# EAGLE design ArduinoProMini.NRF24.DHT (EAGLE 8.0.2)
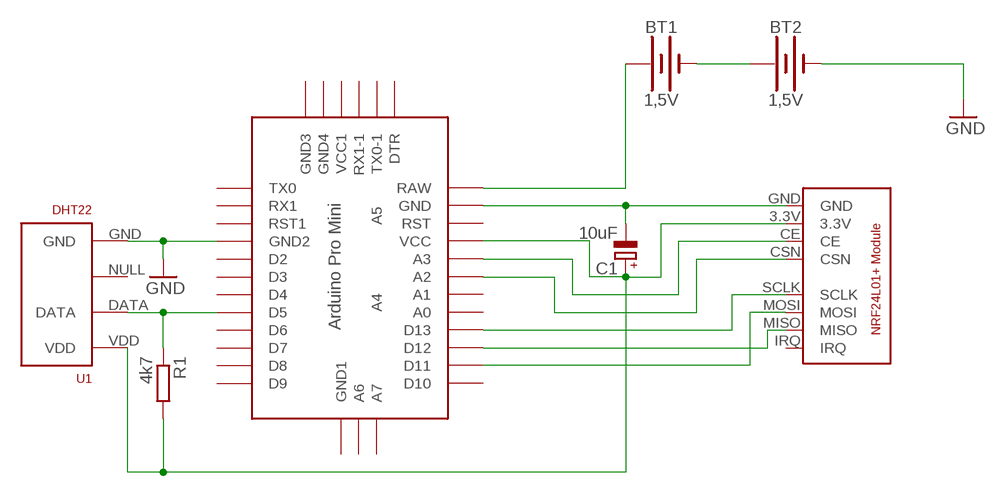
[diagram p0: schematic, sheet 1]

## Parts
BT1  1,5V  BATTERY-AA  [BATTERY-AA]
BT2  1,5V  BATTERY-AA  [BATTERY-AA]
C1  10uF  CPOL-EUE2-5  [E2-5]
R1  4k7  R-EU_0204/7  [0204/7]
U1  DHT22  RHT03_DHT-22_AM2302RA  [RHT03_DHT-22/RA]
U$1  ABK-PRO-MINI  [ABK-PRO-MINI]
U$2  NRF24L01+MODULE  [NRF24L01+MODULE]

## Nets
3.3V: C1.+ R1.2 U1.VDD U$1.VCC U$2.3.3V
GND: BT2.GND@1(-) C1.- U1.GND U$1.GND U$1.GND1(GND2) U$2.GND
N$1: BT1.GND@1(-) BT2.PWR@1(+)
N$2: R1.1 U1.DATA U$1.D5
N$6: U$1.A3 U$2.CE
N$7: U$1.A2 U$2.CSN
N$8: U$1.D13 U$2.SCLK
N$9: U$1.D11 U$2.MOSI
N$10: U$1.D12 U$2.MISO
RAW: BT1.PWR@1(+) U$1.RAW
Unconnected: U1.NULL U$1.A0 U$1.A1 U$1.A4 U$1.A5 U$1.A6 U$1.A7 U$1.D2 U$1.D3 U$1.D4 U$1.D6 U$1.D7 U$1.D8 U$1.D9 U$1.D10 U$1.DTR U$1.GND2(GND3) U$1.GND3(GND4) U$1.GND4(GND1) U$1.RST U$1.RST1 U$1.RX1 U$1.RX1-1 U$1.TX0 U$1.TX0-1 U$1.VCC1 U$2.IRQ

## Library data of the parts
BT1 BT2 = SparkFun-Batteries:BATTERY: Battery - Single Cell A variety of battery chemistries, sizes, and footprints. Device List: 20MM_PTH - Coin Cell Battery Holder - 20mm (PTH) <https://www.sparkfun.com/products/783> 12MM_SMD - Coin Cell Battery Holder - 12mm (SMD) <https://www.sparkfun.com/products/10592> 12MM_PTH - Coin Cell Battery Holder - 12mm (PTH) <https://www.sparkfun.com/products/7948> 20MM_SMD - 20mm Coin Cell Battery Holder (SMD) (2 legs) Used on the Big Time Watch Kit <https://www.sparkfun.com/products/11734> 20MM_SMD_4LEGS - Coin Cell Battery Holder - 20mm (SMD) <https://www.sparkfun.com/products/11892> 20MM_SMD_4LEGS_OVERPASTE - Coin Cell Battery Holder - 20mm (SMD) <https://www.sparkfun.com/products/11892> (Over-paste on the legs) 24.5MM_PTH - Coin Cell Battery Holder - 24.5mm (PTH) <https://www.sparkfun.com/products/8863> 9V - 9V Battery Holder - PC Mount Used on the SparkFun SparkPunk Sound Kit <https://www.sparkfun.com/products/11177> and SparkFun SparkPunk Sequencer Kit <https://www.sparkfun.com/products/12707> 18650 - Battery Holder - 18650 (PTH) <https://www.sparkfun.com/products/13113> AA - Battery Holder - 1xAA (PTH) <https://www.sparkfun.com/products/7949> AAA - Battery Holder - 1xAAA (PTH) <https://www.sparkfun.com/products/12718> AA_KIT - Battery Holder - 1xAA (PTH) <https://www.sparkfun.com/products/7949> Special kit package - pads only have exposed copper on one side of the board. AAA_KIT - Battery Holder - 1xAAA (PTH) <https://www.sparkfun.com/products/12718> Special kit package - pads only have exposed copper on one side of the board.; PROD_ID: BATT-08316; SF_SKU: PRT-07949
C1 = rcl:CPOL-EU: POLARIZED CAPACITOR, European symbol
R1 = resistor:R-EU_: RESISTOR, European symbol
U1 = RHT03_DHT-22_AM2302:RHT03_DHT-22_AM2302: RHT03 / DHT-22 / AM2302 Packages and symbol for the RHT03 / DHT-22 relative humidity and temperature sensor. Note: The AM2302 is a wired version of the DHT-22 which typically requires less clearance and is thus provided as a separate package.; PROD_ID: SEN-10167
U$1 = Arduino-clone:ABK-PRO-MINI: ABK Pro-Mini Arduino Clone
U$2 = NRF24L01+ Module:NRF24L01+MODULE

## Board
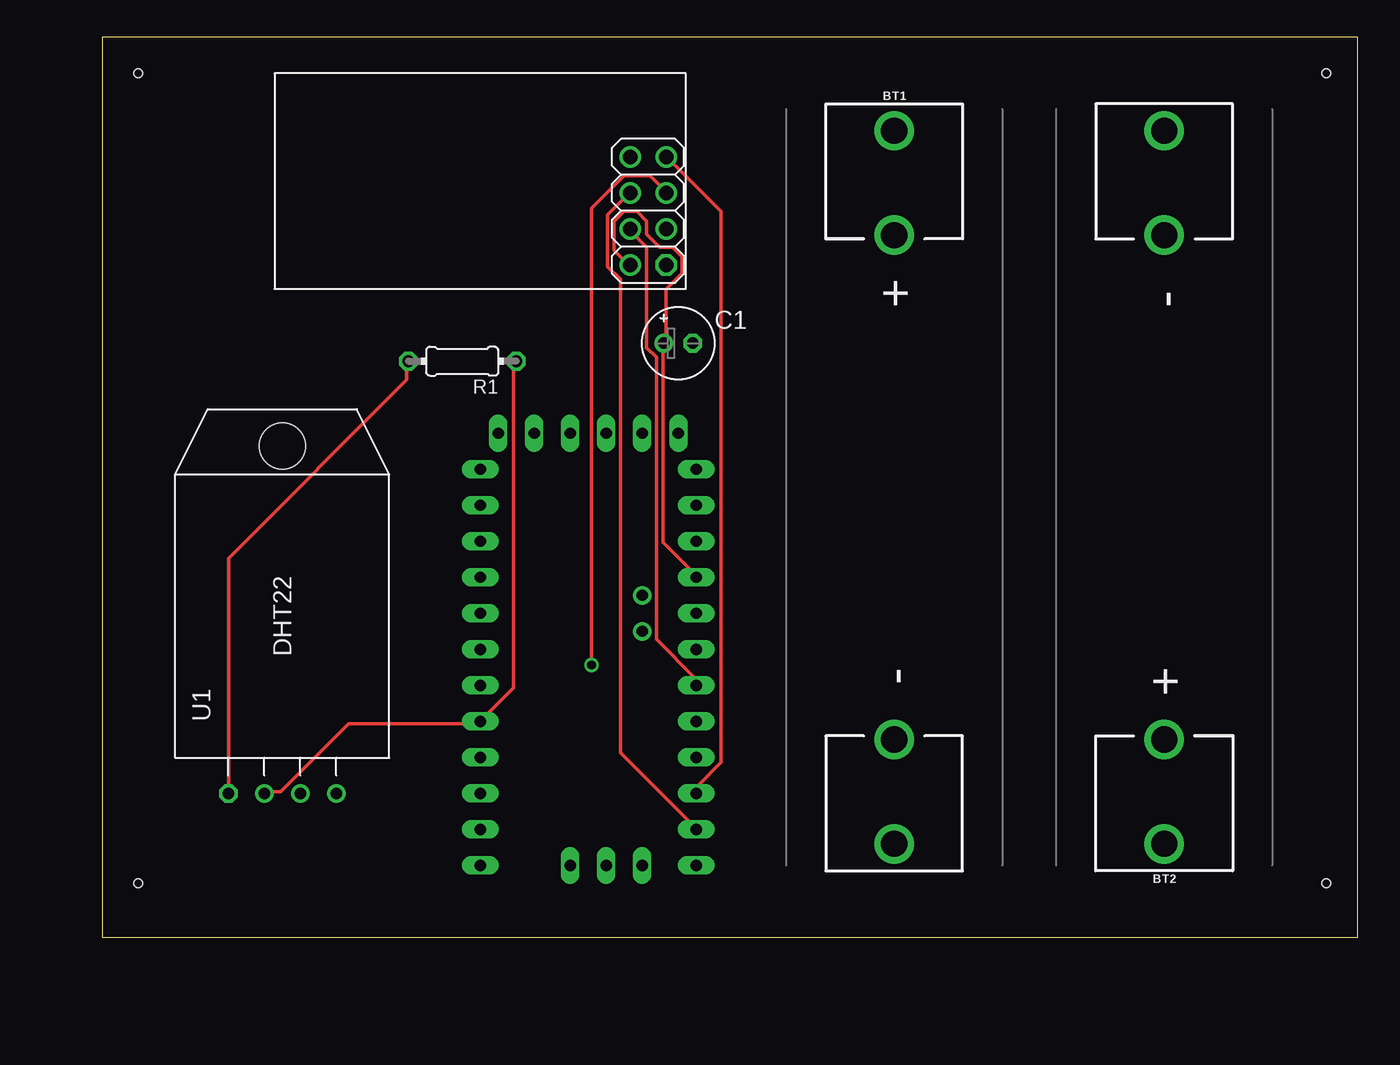
[diagram p1: board, top side]
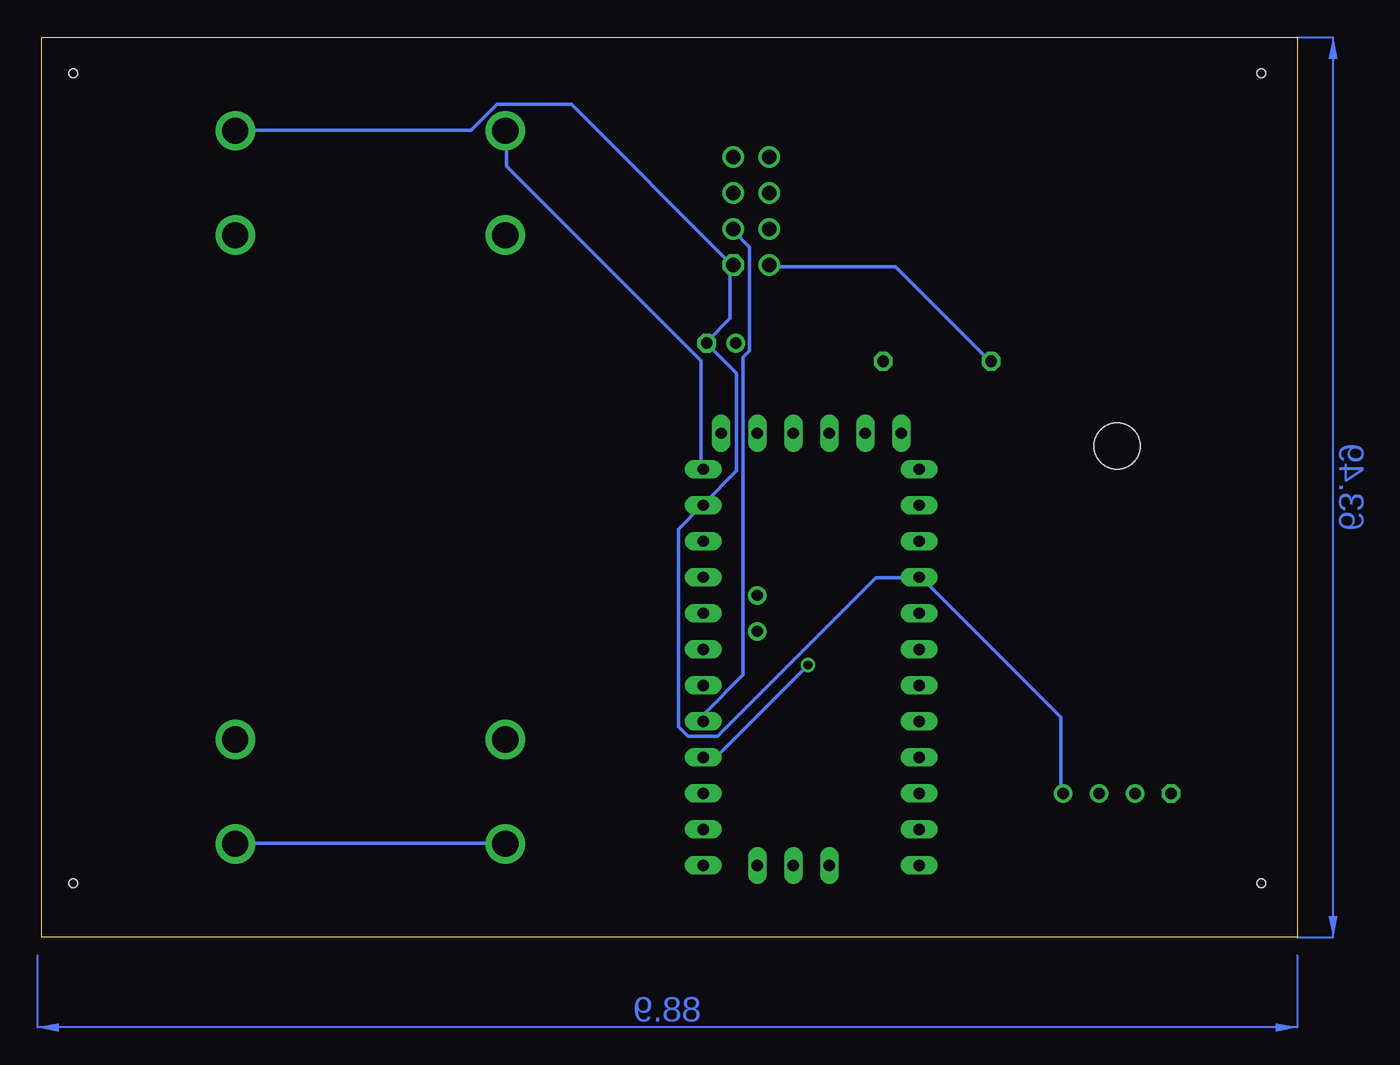
[diagram p2: board, bottom side, seen from below]

Size 88.57 x 63.49 mm. Coordinates in mm from the lower left corner, seen from the top.
Outline: 0,0 88.57,0 88.57,63.49 0,63.49 0,0
Copper layers (1*16): Top 0.035mm / dielectric 1.5mm / Bottom 0.035mm
Design rules "default": minimum track width 10mil, minimum drill 24mil, track to track 8mil, track to pad 8mil, pad to pad 8mil, via to via 8mil, smd to smd 8mil, copper to edge 40mil, drill to drill 8mil, minimum pad ring 10mil, minimum via ring 8mil, stop-mask expansion 4mil, vias tented up to drill 0mil, thermal gap 10mil
Holes 0.6 mm at 2.54,3.81 2.54,60.96 86.36,60.96 86.36,3.81

### Footprints (pad centres in the part's own frame; a part is rotated, then mirrored left to right if it is on the bottom)
BATTERY-AA = drill 1.854: GND@1 25.146,0; GND@2 17.78,0; PWR@1 -25.146,0; PWR@2 -17.78,0
E2-5 = drill 0.813 pad 1.27: + -1.016,0 | drill 0.813 pad 1.27 octagon: - 1.016,0
0204/7 = drill 0.813 octagon: 1 -3.81,0; 2 3.81,0
RHT03_DHT-22/RA = drill 0.8: DATA -1.27,0; GND 3.81,0; NULL 1.27,0 | drill 0.8 octagon: VDD -3.81,0 | hole 3.25: 0,24.5
ABK-PRO-MINI = drill 0.8 long: A0 10.16,-3.81; A1 10.16,-6.35; A2 10.16,-8.89; A3 10.16,-11.43; A6 3.81,-21.59; A7 6.35,-21.59; D2 -5.08,-3.81; D3 -5.08,-6.35; D4 -5.08,-8.89; D5 -5.08,-11.43; D6 -5.08,-13.97; D7 -5.08,-16.51; D8 -5.08,-19.05; D9 -5.08,-21.59; D10 10.16,-21.59; D11 10.16,-19.05; D12 10.16,-16.51; D13 10.16,-13.97; DTR 8.89,8.89; GND 10.16,3.81; GND1 -5.08,-1.27; GND2 -3.81,8.89; GND3 -1.27,8.89; GND4 1.27,-21.59; RAW 10.16,6.35; RST 10.16,1.27; RST1 -5.08,1.27; RX1 -5.08,3.81; RX1-1 3.81,8.89; TX0 -5.08,6.35; TX0-1 6.35,8.89; VCC 10.16,-1.27; VCC1 1.27,8.89 | drill 0.8: A4 6.35,-5.08; A5 6.35,-2.54
NRF24L01+MODULE = drill 1.016: 3.3V 10.58,-5.91; CE 13.12,-3.37; CSN 10.58,-3.37; IRQ 10.58,1.71; MISO 13.12,1.71; MOSI 10.58,-0.83; SCLK 13.12,-0.83 | drill 1.016 octagon: GND 13.12,-5.91

### Placement (x,y rotation side)
BT1  55.88,31.75 270 top
BT2  74.93,31.75 90 top
C1  40.64,41.91 0 top
R1  25.4,40.64 180 top
U1  12.7,10.16 0 top
U$1  31.75,26.67 0 top
U$2  26.67,53.34 0 top

### Tracks (layer width: path | path; a pad name or v marks a point on that pad's centre or on a via)
3.3V
  Top 0.254: U$1.VCC 41.83,25.6 39.55,27.89 39.55,41.83 C1.+ 39.78,42.06 39.78,45.72 40.92,46.86 40.92,48.01 40.23,48.69 39.32,48.69 38.41,49.61 38.41,50.52 37.72,51.21 36.8,51.21 36.12,50.52 36.12,48.46 37.03,47.55 U$2.3.3V | U1.VDD 8.91,10.29 8.91,26.75 21.49,39.32 21.49,40.46 R1.2
  Bottom 0.254: U$2.3.3V 37.03,47.32 28.35,47.32 21.72,40.69 R1.2
GND
  Bottom 0.254: U1.GND 16.69,10.29 16.69,15.54 26.52,25.38 U$1.GND1 26.75,25.38 29.72,25.38 40.92,14.17 42.98,14.17 43.66,14.86 43.66,28.8 42.06,30.4 U$1.GND 41.83,30.63 39.55,32.92 39.55,39.78 41.6,41.83 C1.- 41.6,42.06 40.01,43.66 40.01,47.32 U$2.GND 40.01,47.55 51.21,58.75 56.46,58.75 58.29,56.92 74.75,56.92 BT2.GND@1
N$1
  Bottom 0.254: BT1.GND@1 56.01,6.63 74.75,6.63 BT2.PWR@1
N$2
  Top 0.254: U1.DATA 11.43,10.29 12.57,10.29 17.37,15.09 26.52,15.09 U$1.D5 29.03,17.6 29.03,40.46 R1.1
N$6
  Bottom 0.254: U$1.A3 41.83,15.32 41.83,15.77 39.09,18.52 39.09,40.92 38.63,41.38 38.63,48.69 39.78,49.84 U$2.CE
N$7
  Top 0.254: U$1.A2 41.83,17.83 41.83,18.29 39.09,21.03 39.09,40.92 38.41,41.6 38.41,48.69 37.26,49.84 U$2.CSN
N$8  (via drill 0.61)
  Top 0.254: v34.52,19.2 34.52,51.44 36.8,53.72 38.63,53.72 39.78,52.58 U$2.SCLK
  Bottom 0.254: v34.52,19.2 40.92,12.8 41.83,12.8 U$1.D13
N$9
  Top 0.254: U$1.D11 41.83,7.77 36.58,13.03 36.58,46.41 35.66,47.32 35.66,50.98 37.03,52.35 U$2.MOSI
N$10
  Top 0.254: U$1.D12 42.06,10.29 42.06,10.74 43.66,12.34 43.66,51.21 40.01,54.86 U$2.MISO
RAW
  Bottom 0.254: U$1.RAW 42.06,33.15 42.06,40.69 55.78,54.41 55.78,56.69 BT1.PWR@1
(copper drawn outside any net)
  shapes: Bottom area x2